# Altium schematic sheet Relay PCB.SchDoc
size A4
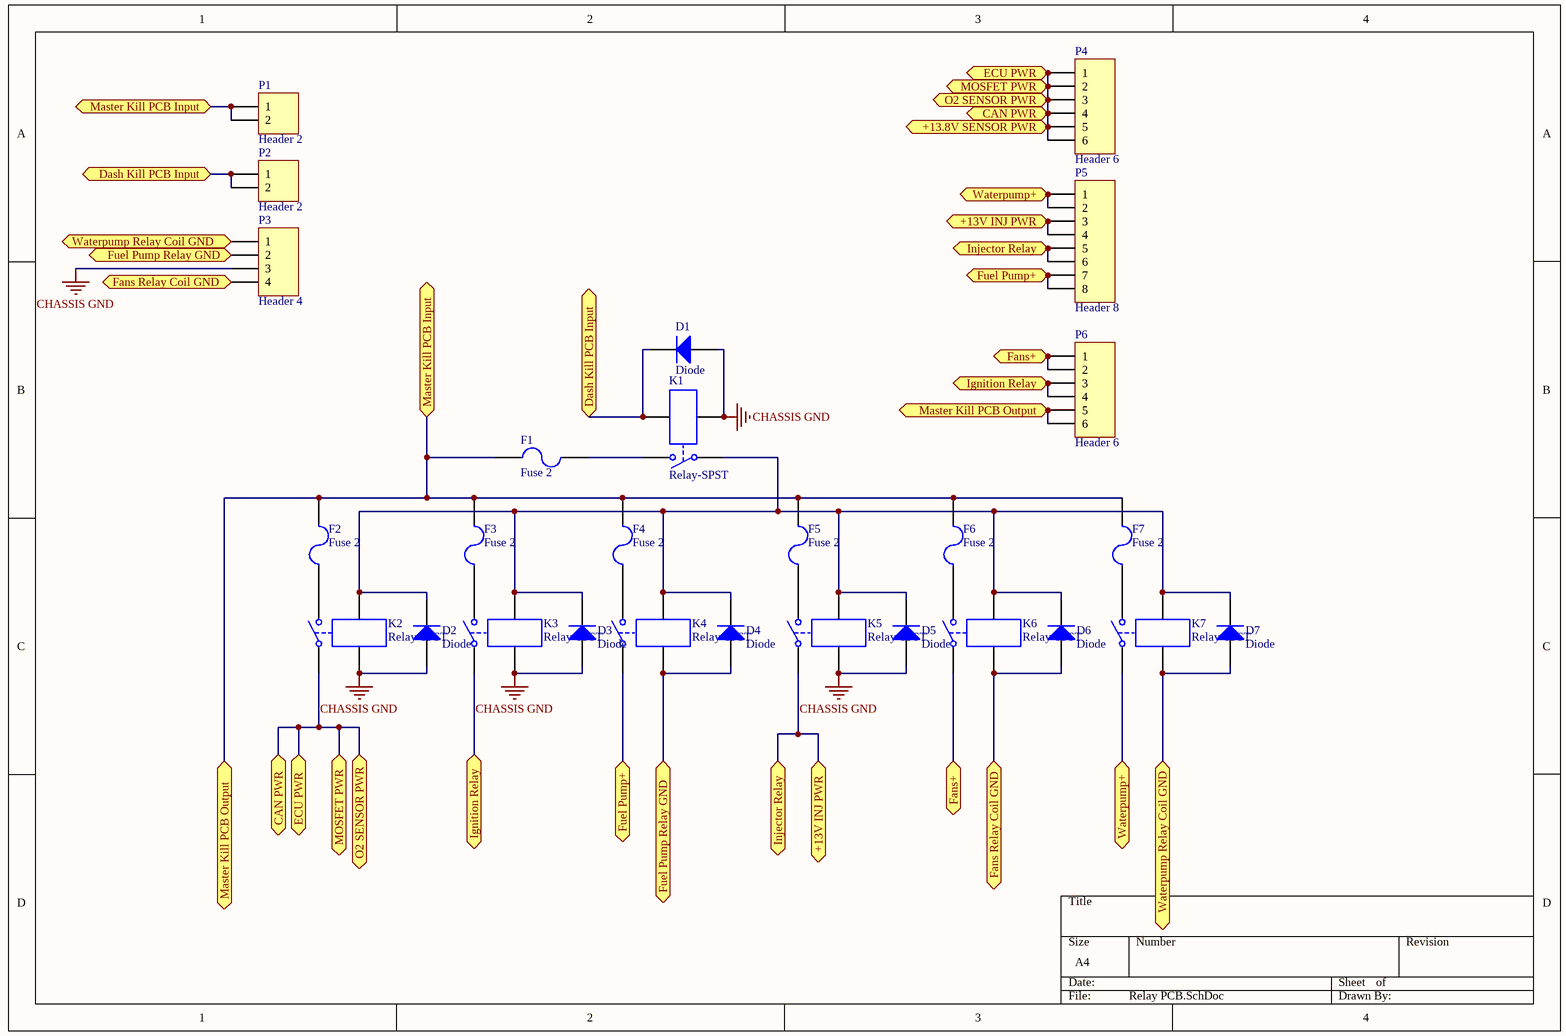
[diagram p0: Relay PCB.SchDoc]

## Parts
D1  Diode  [SMC]
D2  Diode  [SMC]
D3  Diode  [SMC]
D4  Diode  [SMC]
D5  Diode  [SMC]
D6  Diode  [SMC]
D7  Diode  [SMC]
F1  Fuse 2  [PIN-W2/E2.8]
F2  Fuse 2  [PIN-W2/E2.8]
F3  Fuse 2  [PIN-W2/E2.8]
F4  Fuse 2  [PIN-W2/E2.8]
F5  Fuse 2  [PIN-W2/E2.8]
F6  Fuse 2  [PIN-W2/E2.8]
F7  Fuse 2  [PIN-W2/E2.8]
K1  Relay-SPST  [MODULE4]
K2  Relay-SPST  [MODULE4]
K3  Relay-SPST  [MODULE4]
K4  Relay-SPST  [MODULE4]
K5  Relay-SPST  [MODULE4]
K6  Relay-SPST  [MODULE4]
K7  Relay-SPST  [MODULE4]
P1  Header 2  [HDR1X2]
P2  Header 2  [HDR1X2]
P3  Header 4  [HDR1X4]
P4  Header 6  [HDR1X6]
P5  Header 8  [HDR1X8]
P6  Header 6  [HDR1X6]

## Ports
+13.8V SENSOR PWR, +13V INJ PWR, CAN PWR, Dash Kill PCB Input, ECU PWR, Fans Relay Coil GND, Fans+, Fuel Pump Relay GND, Fuel Pump+, Ignition Relay, Injector Relay, Master Kill PCB Input, Master Kill PCB Output, MOSFET PWR, O2 SENSOR PWR, Waterpump Relay Coil GND, Waterpump+

## Nets
CHASSIS GND: D1.1(A) D2.1(A) D3.1(A) D5.1(A) K1.3 K2.3 K3.3 K5.3 P3.3
+13.8V SENSOR PWR: K2.1 P4.1 P4.2 P4.3 P4.4 P4.5 P4.6 ; port ECU PWR, port MOSFET PWR, port O2 SENSOR PWR, port CAN PWR, port +13.8V SENSOR PWR
+13V INJ PWR: K5.1 P5.3 P5.4 P5.5 P5.6 ; port Injector Relay, port +13V INJ PWR
Dash Kill PCB Input: D1.2(K) K1.4 P2.1 P2.2 ; port Dash Kill PCB Input
Fans Relay Coil GND: D6.1(A) K6.3 P3.4 ; port Fans Relay Coil GND
Fans+: K6.1 P6.1 P6.2 ; port Fans+
Fuel Pump Relay GND: D4.1(A) K4.3 P3.2 ; port Fuel Pump Relay GND
Fuel Pump+: K4.1 P5.7 P5.8 ; port Fuel Pump+
Ignition Relay: K3.1 P6.3 P6.4 ; port Ignition Relay
Master Kill PCB Input: F1.1 F2.2 F3.2 F4.2 F5.2 F6.2 F7.2 P1.1 P1.2 P6.5 P6.6 ; port Master Kill PCB Input, port Master Kill PCB Output
Waterpump Relay Coil GND: D7.1(A) K7.3 P3.1 ; port Waterpump Relay Coil GND
Waterpump+: K7.1 P5.1 P5.2 ; port Waterpump+
NetD2_2: D2.2(K) D3.2(K) D4.2(K) D5.2(K) D6.2(K) D7.2(K) K1.1 K2.4 K3.4 K4.4 K5.4 K6.4 K7.4
NetF1_2: F1.2 K1.2
NetF2_1: F2.1 K2.2
NetF3_1: F3.1 K3.2
NetF4_1: F4.1 K4.2
NetF5_1: F5.1 K5.2
NetF6_1: F6.1 K6.2
NetF7_1: F7.1 K7.2

## Library data of the parts
D1-D7 = Diode: Default Diode; Published: 8-Jun-2000; LatestRevisionDate: 17-Jul-2002; LatestRevisionNote: Re-released for DXP Platform.; PackageVersion: Sep-1996; PackageReference: SMC; Publisher: Altium Limited; PackageDescription: DO-214-AB/SMC; 2 C-Bend Leads; Body 7.9 x 5.9 mm, inc. leads (LxW); Code_JEDEC: DO-214-AB
F1-F7 = Fuse 2: Fuse; Published: 8-Jun-2000; LatestRevisionDate: 17-Jul-2002; LatestRevisionNote: Re-released for DXP Platform.; PackageReference: PIN-W2/E2.8; Publisher: Altium Limited; PackageDescription: Thru-Hole; 2 Leads
K1-K7 = Relay-SPST: Single-Pole Single-Throw Relay; Published: 24-Mar-1999; LatestRevisionDate: 17-Jul-2002; LatestRevisionNote: Re-released for DXP Platform.; PackageReference: MODULE4; Publisher: Altium Limited
P1 P2 = Header 2: Header, 2-Pin; LatestRevisionDate: 17-Jul-2002; LatestRevisionNote: Re-released for DXP Platform.; Publisher: Altium Limited
P3 = Header 4: Header, 4-Pin; LatestRevisionDate: 17-Jul-2002; LatestRevisionNote: Re-released for DXP Platform.; Publisher: Altium Limited
P4 P6 = Header 6: Header, 6-Pin; LatestRevisionDate: 17-Jul-2002; LatestRevisionNote: Re-released for DXP Platform.; Publisher: Altium Limited
P5 = Header 8: Header, 8-Pin; LatestRevisionDate: 17-Jul-2002; LatestRevisionNote: Re-released for DXP Platform.; Publisher: Altium Limited